# Altium schematic sheet Microcontroller.SchDoc
size B
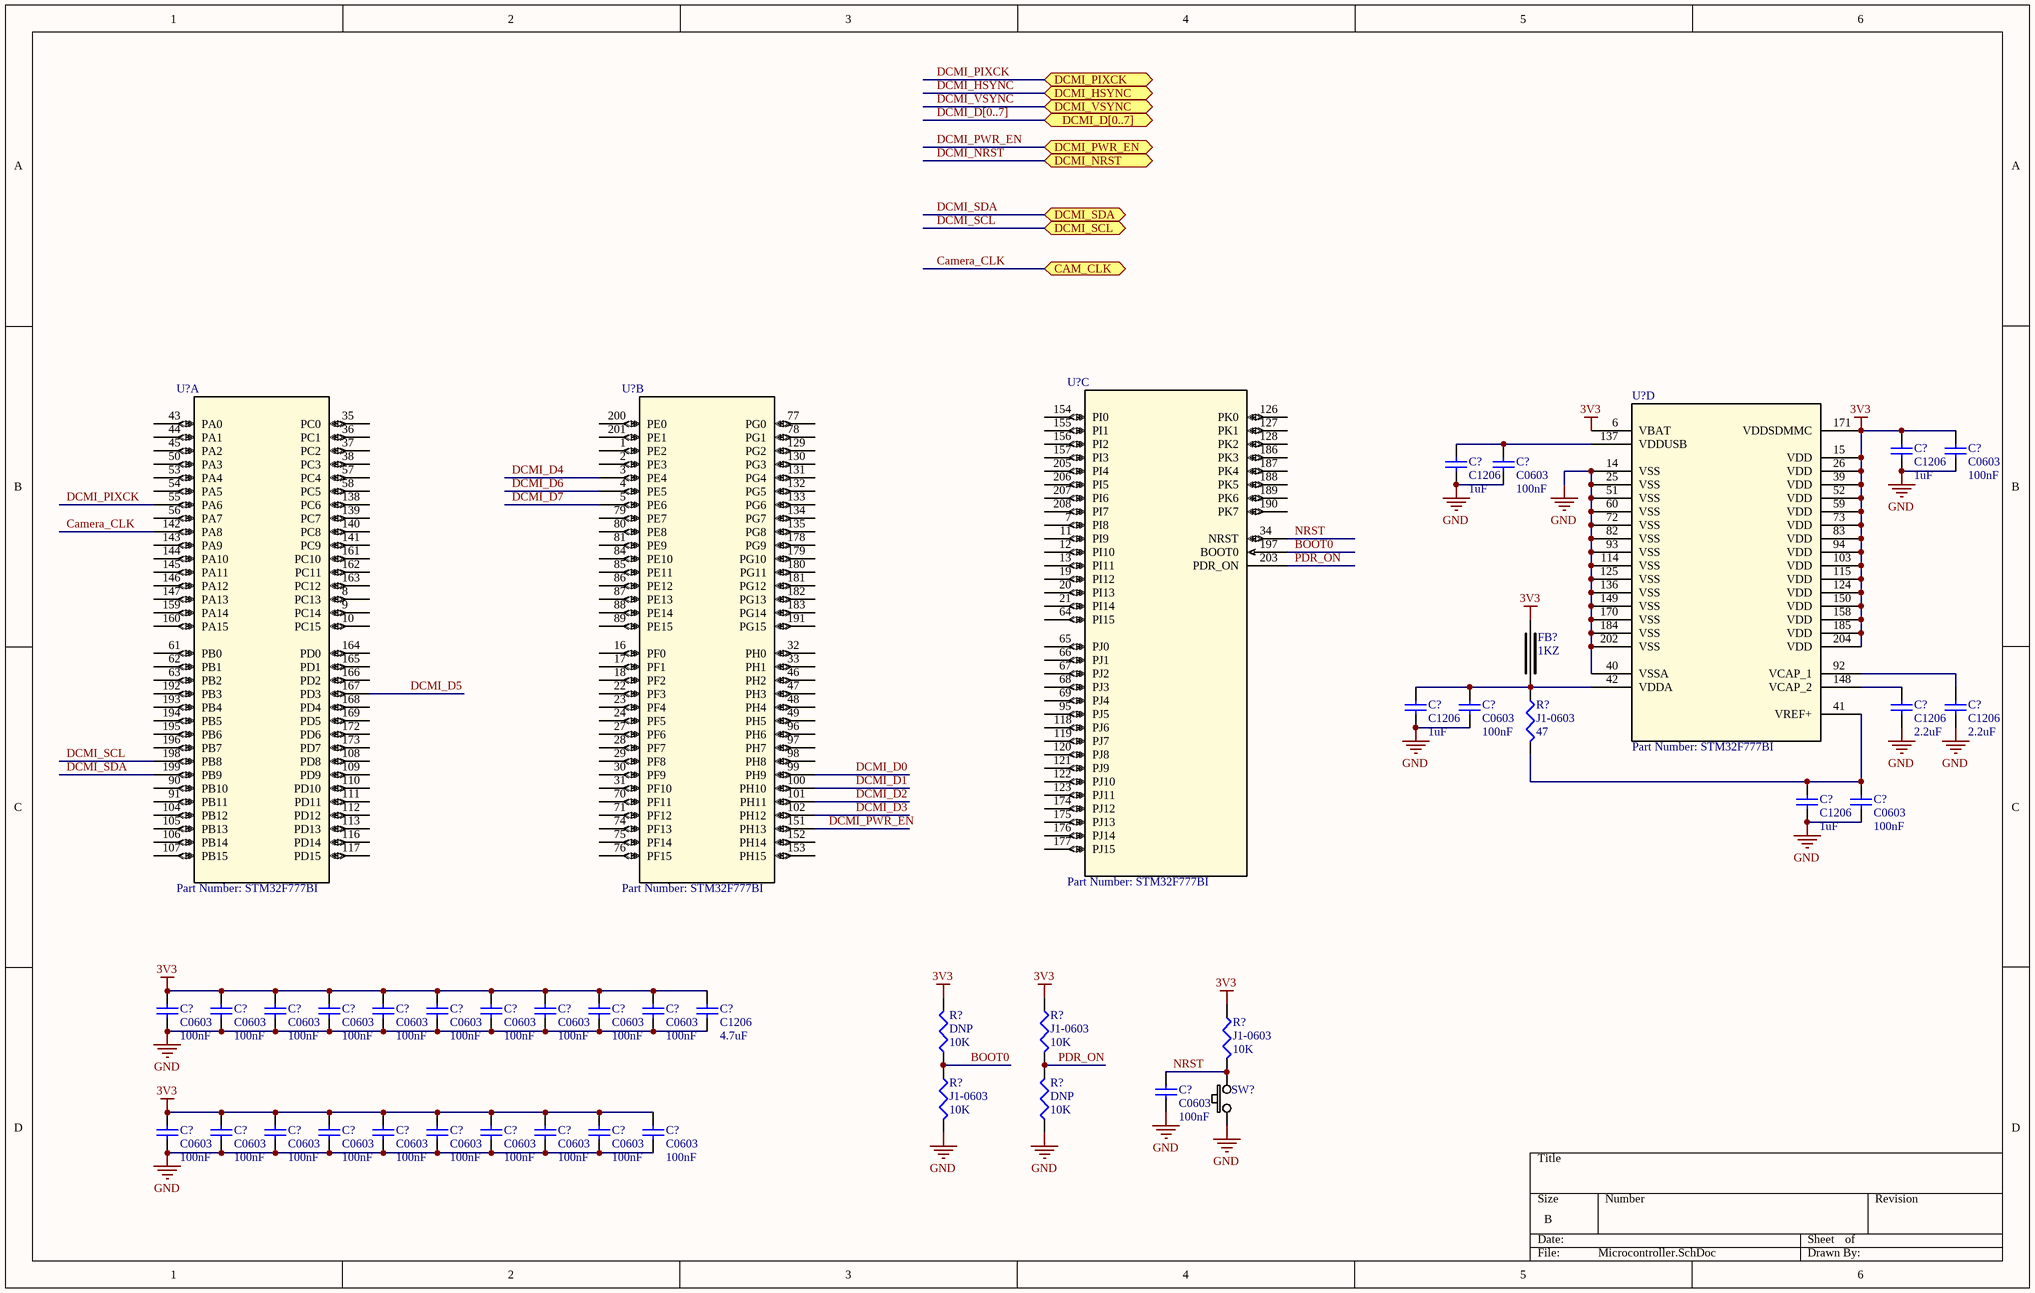
[diagram p0: Microcontroller.SchDoc]

## Parts
(Parts that share a designator on the sheet are numbered #1, #2 ... from top to bottom, then left to right.)
C?#1  C1206  value 1uF  [C1206]
C?#2  C0603  value 100nF  [1608[0603]]
C?#3  C1206  value 1uF  [C1206]
C?#4  C0603  value 100nF  [1608[0603]]
C?#5  C1206  value 1uF  [C1206]
C?#6  C0603  value 100nF  [1608[0603]]
C?#7  C1206  value 2.2uF  [C1206]
C?#8  C1206  value 2.2uF  [C1206]
C?#9  C1206  value 1uF  [C1206]
C?#10  C0603  value 100nF  [1608[0603]]
C?#11  C0603  value 100nF  [1608[0603]]
C?#12  C0603  value 100nF  [1608[0603]]
C?#13  C0603  value 100nF  [1608[0603]]
C?#14  C0603  value 100nF  [1608[0603]]
C?#15  C0603  value 100nF  [1608[0603]]
C?#16  C0603  value 100nF  [1608[0603]]
C?#17  C0603  value 100nF  [1608[0603]]
C?#18  C0603  value 100nF  [1608[0603]]
C?#19  C0603  value 100nF  [1608[0603]]
C?#20  C0603  value 100nF  [1608[0603]]
C?#21  C1206  value 4.7uF  [C1206]
C?#22  C0603  value 100nF  [1608[0603]]
C?#23  C0603  value 100nF  [1608[0603]]
C?#24  C0603  value 100nF  [1608[0603]]
C?#25  C0603  value 100nF  [1608[0603]]
C?#26  C0603  value 100nF  [1608[0603]]
C?#27  C0603  value 100nF  [1608[0603]]
C?#28  C0603  value 100nF  [1608[0603]]
C?#29  C0603  value 100nF  [1608[0603]]
C?#30  C0603  value 100nF  [1608[0603]]
C?#31  C0603  value 100nF  [1608[0603]]
C?#32  C0603  value 100nF  [1608[0603]]
FB?  1KZ  [0603FB-1KZ]
R?#1  J1-0603  value 47  [RESC1608X06N]
R?#2  J1-0603  value 10K  [RESC1608X06N]
R?#3  J1-0603  value 10K  [RESC1608X06N]
R?#4  DNP  value 10K  [RESC1608X06N]
R?#5  J1-0603  value 10K  [RESC1608X06N]
R?#6  DNP  value 10K  [RESC1608X06N]
SW?  SW-PB-BLACK-SMD  [SW-PB-SMD]  (value not drawn)
U?#1  Part Number: STM32F777BI  [LQFP-208_28X28]  (part C of 4)
U?#2  Part Number: STM32F777BI  [LQFP-208_28X28]  (part A of 4)
U?#3  Part Number: STM32F777BI  [LQFP-208_28X28]  (part B of 4)
U?#4  Part Number: STM32F777BI  [LQFP-208_28X28]  (part D of 4)

## Ports
CAM_CLK, DCMI_D[0..7], DCMI_HSYNC, DCMI_NRST, DCMI_PIXCK, DCMI_PWR_EN, DCMI_SCL, DCMI_SDA, DCMI_VSYNC

## Nets
3V3: C?#1.2 C?#2.2 C?#11.2 C?#12.2 C?#13.2 C?#14.2 C?#15.2 C?#16.2 C?#17.2 C?#18.2 C?#19.2 C?#20.2 C?#21.2 C?#23.2 C?#24.2 C?#25.2 C?#26.2 C?#27.2 C?#28.2 C?#29.2 C?#30.2 C?#31.2 C?#32.2 FB?.1 R?#2.1 R?#3.1 R?#4.2 U?#4.6(VBAT) U?#4.15(VDD) U?#4.26(VDD) U?#4.39(VDD) U?#4.52(VDD) U?#4.59(VDD) U?#4.73(VDD) U?#4.83(VDD) U?#4.94(VDD) U?#4.103(VDD) U?#4.115(VDD) U?#4.124(VDD) U?#4.150(VDD) U?#4.158(VDD) U?#4.171(VDDSDMMC) U?#4.185(VDD) U?#4.204(VDD)
GND: C?#1.1 C?#2.1 C?#3.1 C?#4.1 C?#5.1 C?#6.1 C?#7.1 C?#8.1 C?#9.1 C?#10.1 C?#11.1 C?#12.1 C?#13.1 C?#14.1 C?#15.1 C?#16.1 C?#17.1 C?#18.1 C?#19.1 C?#20.1 C?#21.1 C?#22.1 C?#23.1 C?#24.1 C?#25.1 C?#26.1 C?#27.1 C?#28.1 C?#29.1 C?#30.1 C?#31.1 C?#32.1 R?#5.2 R?#6.1 SW?.1 U?#4.14(VSS) U?#4.25(VSS) U?#4.40(VSSA) U?#4.51(VSS) U?#4.60(VSS) U?#4.72(VSS) U?#4.82(VSS) U?#4.93(VSS) U?#4.114(VSS) U?#4.125(VSS) U?#4.136(VSS) U?#4.149(VSS) U?#4.170(VSS) U?#4.184(VSS) U?#4.202(VSS)
BOOT0: R?#4.1 R?#5.1 U?#1.197(BOOT0)
Camera_CLK: U?#2.142(PA8) ; port CAM_CLK
DCMI_D0: U?#3.99(PH9)
DCMI_D1: U?#3.100(PH10)
DCMI_D2: U?#3.101(PH11)
DCMI_D3: U?#3.102(PH12)
DCMI_D4: U?#3.3(PE4)
DCMI_D5: U?#2.167(PD3)
DCMI_D6: U?#3.4(PE5)
DCMI_D7: U?#3.5(PE6)
DCMI_HSYNC: port DCMI_HSYNC
DCMI_NRST: port DCMI_NRST
DCMI_PIXCK: U?#2.55(PA6) ; port DCMI_PIXCK
DCMI_PWR_EN: U?#3.151(PH13) ; port DCMI_PWR_EN
DCMI_SCL: U?#2.198(PB8) ; port DCMI_SCL
DCMI_SDA: U?#2.199(PB9) ; port DCMI_SDA
DCMI_VSYNC: port DCMI_VSYNC
NRST: C?#22.2 R?#3.2 SW?.2 U?#1.34(NRST)
PDR_ON: R?#2.2 R?#6.2 U?#1.203(PDR_ON)
NetC?#3_2: C?#3.2 C?#4.2 U?#4.137(VDDUSB)
NetC?#5_2: C?#5.2 C?#6.2 FB?.2 R?#1.1 U?#4.42(VDDA)
NetC?#7_2: C?#7.2 U?#4.148(VCAP_2)
NetC?#8_2: C?#8.2 U?#4.92(VCAP_1)
NetC?#9_2: C?#9.2 C?#10.2 R?#1.2 U?#4.41(VREF+)

Not connected (* = marked no-connect by the designer): U?#1 7(PI8) 11(PI9) 12(PI10) 13(PI11) 19(PI12) 20(PI13) 21(PI14) 64(PI15) 65(PJ0) 66(PJ1) 67(PJ2) 68(PJ3) 69(PJ4) 95(PJ5) 118(PJ6) 119(PJ7) 120(PJ8) 121(PJ9) 122(PJ10) 123(PJ11) 126(PK0) 127(PK1) 128(PK2) 154(PI0) 155(PI1) 156(PI2) 157(PI3) 174(PJ12) 175(PJ13) 176(PJ14) 177(PJ15) 186(PK3) 187(PK4) 188(PK5) 189(PK6) 190(PK7) 205(PI4) 206(PI5) 207(PI6) 208(PI7); U?#2 8(PC13) 9(PC14) 10(PC15) 35(PC0) 36(PC1) 37(PC2) 38(PC3) 43(PA0) 44(PA1) 45(PA2) 50(PA3) 53(PA4) 54(PA5) 56(PA7) 57(PC4) 58(PC5) 61(PB0) 62(PB1) 63(PB2) 90(PB10) 91(PB11) 104(PB12) 105(PB13) 106(PB14) 107(PB15) 108(PD8) 109(PD9) 110(PD10) 111(PD11) 112(PD12) 113(PD13) 116(PD14) 117(PD15) 138(PC6) 139(PC7) 140(PC8) 141(PC9) 143(PA9) 144(PA10) 145(PA11) 146(PA12) 147(PA13) 159(PA14) 160(PA15) 161(PC10) 162(PC11) 163(PC12) 164(PD0) 165(PD1) 166(PD2) 168(PD4) 169(PD5) 172(PD6) 173(PD7) 192(PB3) 193(PB4) 194(PB5) 195(PB6) 196(PB7); U?#3 1(PE2) 2(PE3) 16(PF0) 17(PF1) 18(PF2) 22(PF3) 23(PF4) 24(PF5) 27(PF6) 28(PF7) 29(PF8) 30(PF9) 31(PF10) 32(PH0) 33(PH1) 46(PH2) 47(PH3) 48(PH4) 49(PH5) 70(PF11) 71(PF12) 74(PF13) 75(PF14) 76(PF15) 77(PG0) 78(PG1) 79(PE7) 80(PE8) 81(PE9) 84(PE10) 85(PE11) 86(PE12) 87(PE13) 88(PE14) 89(PE15) 96(PH6) 97(PH7) 98(PH8) 129(PG2) 130(PG3) 131(PG4) 132(PG5) 133(PG6) 134(PG7) 135(PG8) 152(PH14) 153(PH15) 178(PG9) 179(PG10) 180(PG11) 181(PG12) 182(PG13) 183(PG14) 191(PG15) 200(PE0) 201(PE1)

## Buses and harness runs
bus DCMI_D[0..7] = port DCMI_D[0..7]

## Library data of the parts
C?#1-C?#32 = Cap Semi: Capacitor (Semiconductor SIM Model); Published: 8-Jun-2000; LatestRevisionDate: 29-May-2009; LatestRevisionNote: IPC-7351 Footprint Added.; Publisher: Altium Limited; PackageDescription: Chip Capacitor
  C?#1 C?#3 C?#5 C?#7-C?#9 C?#21: PackageReference: C1206
  C?#2 C?#4 C?#6 C?#10-C?#20 C?#22-C?#32: PackageReference: C0603
FB? = 0603FB-1KZ: FERRITE BEAD 1000 OHM 400mA; Manufacturer: TDK Corporation; Manufacturer Part Number: MMZ1608R102A; Reel: F1; Description: FERRITE CHIP 1000 OHM 400MA 0603; Supplier 1: Digi-Key; Supplier Part Number 1: 445-1548-2-ND
R?#1-R?#6 = Res3: Resistor; Published: 8-Jun-2000; LatestRevisionDate: 29-May-2009; LatestRevisionNote: IPC-7351 Footprint Added.; PackageReference: J1-0603; Publisher: Altium Limited; PackageDescription: Chip Resistor
SW? = SW-PB-BLACK-SMD: PUSHBUTTON SWITCH 6MM SMD
U?#1-U?#4 = STM32F77XBXT: No Description Available; Vendor: STMicroelectronics; Manufacturer_Part_Number: STM32F777BI; Copyright: Copyright (C) 2016 Accelerated Designs. All rights reserved; RefDes: RefDes; Type: DEV; Value: Value